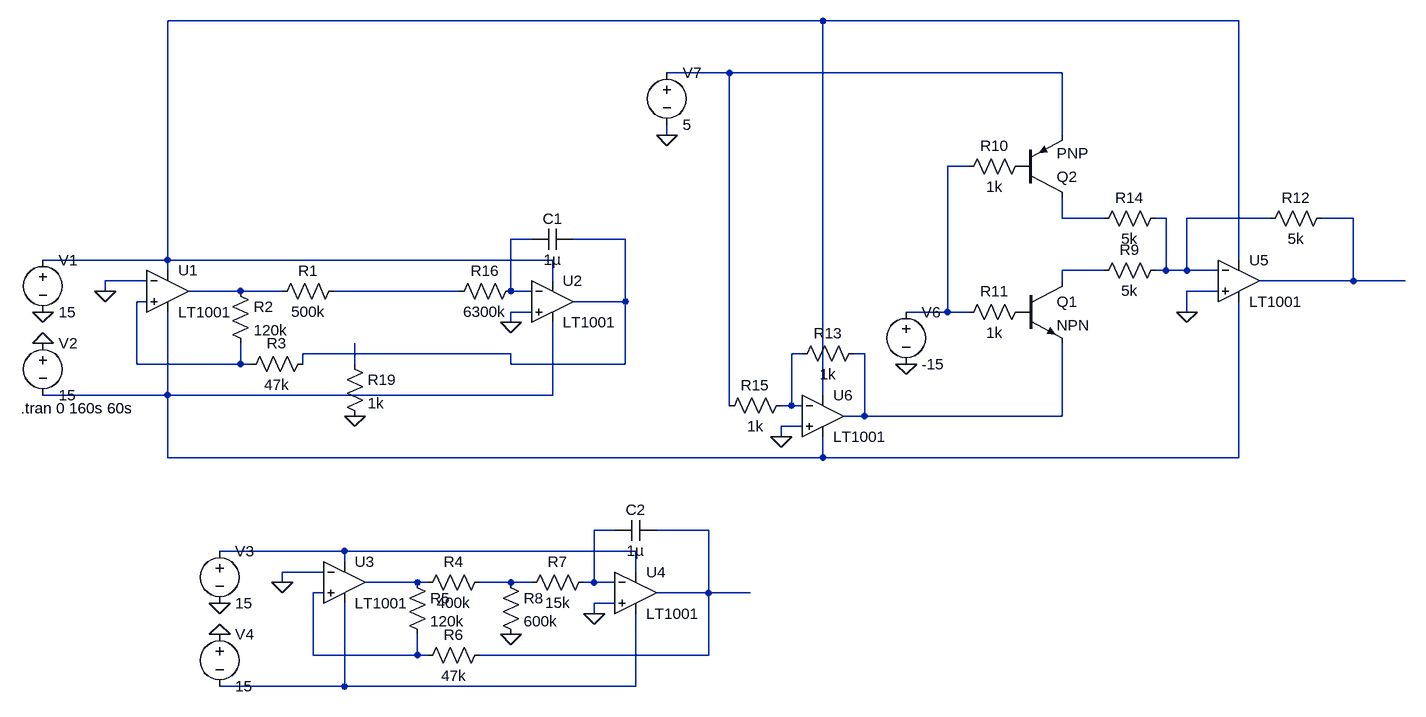
[diagram p0: schematic Supersaw.asc]
Supersaw.asc, the LTspice schematic file:
Version 4
SHEET 1 1540 932
WIRE 512 -256 -496 -256
WIRE 1152 -256 512 -256
WIRE 368 -176 272 -176
WIRE 880 -176 368 -176
WIRE 272 -80 272 -96
WIRE 880 -80 880 -176
WIRE 736 -32 704 -32
WIRE 880 48 880 16
WIRE 944 48 880 48
WIRE 1040 48 1024 48
WIRE 1200 48 1072 48
WIRE 1328 48 1280 48
WIRE 64 80 32 80
WIRE 208 80 128 80
WIRE -496 112 -496 -256
WIRE -496 112 -688 112
WIRE 96 112 -496 112
WIRE 1152 112 1152 -256
WIRE -496 128 -496 112
WIRE 944 128 880 128
WIRE 1040 128 1040 48
WIRE 1040 128 1024 128
WIRE 1072 128 1072 48
WIRE 1072 128 1040 128
WIRE 1120 128 1072 128
WIRE -528 144 -592 144
WIRE 96 144 96 112
WIRE 880 144 880 128
WIRE 1328 144 1328 48
WIRE 1328 144 1184 144
WIRE 1408 144 1328 144
WIRE -592 160 -592 144
WIRE -384 160 -464 160
WIRE -320 160 -384 160
WIRE -48 160 -240 160
WIRE 32 160 32 80
WIRE 64 160 32 160
WIRE 1120 160 1072 160
WIRE -528 176 -544 176
WIRE 208 176 208 80
WIRE 208 176 128 176
WIRE 64 192 32 192
WIRE 704 192 704 -32
WIRE 704 192 640 192
WIRE 736 192 704 192
WIRE 1072 192 1072 160
WIRE 32 208 32 192
WIRE 32 256 -288 256
WIRE 480 256 464 256
WIRE 576 256 560 256
WIRE -544 272 -544 176
WIRE -384 272 -384 240
WIRE -384 272 -544 272
WIRE -368 272 -384 272
WIRE -288 272 -288 256
WIRE -208 272 -208 240
WIRE 32 272 32 256
WIRE 208 272 208 176
WIRE 208 272 32 272
WIRE -496 320 -496 192
WIRE -496 320 -688 320
WIRE 96 320 96 208
WIRE 96 320 -496 320
WIRE 512 320 512 -256
WIRE 368 336 368 -176
WIRE 464 336 464 256
WIRE 464 336 448 336
WIRE 480 336 464 336
WIRE 576 352 576 256
WIRE 576 352 544 352
WIRE 880 352 880 240
WIRE 880 352 576 352
WIRE 480 368 448 368
WIRE 448 384 448 368
WIRE -496 416 -496 320
WIRE 512 416 512 384
WIRE 512 416 -496 416
WIRE 1152 416 1152 176
WIRE 1152 416 512 416
WIRE 192 528 160 528
WIRE 336 528 256 528
WIRE -224 560 -416 560
WIRE 224 560 -224 560
WIRE -224 576 -224 560
WIRE -256 592 -320 592
WIRE 224 592 224 560
WIRE -320 608 -320 592
WIRE -112 608 -192 608
WIRE -96 608 -112 608
WIRE 32 608 -16 608
WIRE 64 608 32 608
WIRE 160 608 160 528
WIRE 160 608 144 608
WIRE 192 608 160 608
WIRE -256 624 -272 624
WIRE 336 624 336 528
WIRE 336 624 256 624
WIRE 400 624 336 624
WIRE 192 640 160 640
WIRE 160 656 160 640
WIRE -272 720 -272 624
WIRE -112 720 -112 688
WIRE -112 720 -272 720
WIRE -96 720 -112 720
WIRE 336 720 336 624
WIRE 336 720 -16 720
WIRE -224 768 -224 640
WIRE -224 768 -416 768
WIRE 224 768 224 656
WIRE 224 768 -224 768
FLAG -592 160 0
FLAG 32 208 0
FLAG -688 192 0
FLAG -688 240 0
FLAG -320 608 0
FLAG 160 656 0
FLAG -416 640 0
FLAG -416 688 0
FLAG 32 688 0
FLAG 640 272 0
FLAG 1072 192 0
FLAG 272 -80 0
FLAG 448 384 0
FLAG -208 352 0
SYMBOL Opamps\\LT1001 -496 96 R0
SYMATTR InstName U1
SYMBOL Opamps\\LT1001 96 112 R0
SYMATTR InstName U2
SYMBOL res -336 176 R270
WINDOW 0 32 56 VTop 2
WINDOW 3 0 56 VBottom 2
SYMATTR InstName R1
SYMATTR Value 500k
SYMBOL res -400 144 R0
SYMATTR InstName R2
SYMATTR Value 120k
SYMBOL res -272 256 R90
WINDOW 0 0 56 VBottom 2
WINDOW 3 32 56 VTop 2
SYMATTR InstName R3
SYMATTR Value 47k
SYMBOL cap 64 96 R270
WINDOW 0 32 32 VTop 2
WINDOW 3 0 32 VBottom 2
SYMATTR InstName C1
SYMATTR Value 1µ
SYMBOL voltage -688 96 R0
WINDOW 123 0 0 Left 2
WINDOW 39 0 0 Left 2
SYMATTR InstName V1
SYMATTR Value 15
SYMBOL voltage -688 224 R0
WINDOW 123 0 0 Left 2
WINDOW 39 0 0 Left 2
SYMATTR InstName V2
SYMATTR Value 15
SYMBOL Opamps\\LT1001 -224 544 R0
SYMATTR InstName U3
SYMBOL Opamps\\LT1001 224 560 R0
SYMATTR InstName U4
SYMBOL res -112 624 R270
WINDOW 0 32 56 VTop 2
WINDOW 3 0 56 VBottom 2
SYMATTR InstName R4
SYMATTR Value 400k
SYMBOL res -128 592 R0
SYMATTR InstName R5
SYMATTR Value 120k
SYMBOL res 0 704 R90
WINDOW 0 0 56 VBottom 2
WINDOW 3 32 56 VTop 2
SYMATTR InstName R6
SYMATTR Value 47k
SYMBOL cap 192 544 R270
WINDOW 0 32 32 VTop 2
WINDOW 3 0 32 VBottom 2
SYMATTR InstName C2
SYMATTR Value 1µ
SYMBOL voltage -416 544 R0
WINDOW 123 0 0 Left 2
WINDOW 39 0 0 Left 2
SYMATTR InstName V3
SYMATTR Value 15
SYMBOL voltage -416 672 R0
WINDOW 123 0 0 Left 2
WINDOW 39 0 0 Left 2
SYMATTR InstName V4
SYMATTR Value 15
SYMBOL res 48 624 R270
WINDOW 0 32 56 VTop 2
WINDOW 3 0 56 VBottom 2
SYMATTR InstName R7
SYMATTR Value 15k
SYMBOL res 16 592 R0
SYMATTR InstName R8
SYMATTR Value 600k
SYMBOL npn 816 144 R0
SYMATTR InstName Q1
SYMBOL res 1040 112 R90
WINDOW 0 0 56 VBottom 2
WINDOW 3 32 56 VTop 2
SYMATTR InstName R9
SYMATTR Value 5k
SYMBOL res 720 208 R270
WINDOW 0 32 56 VTop 2
WINDOW 3 0 56 VBottom 2
SYMATTR InstName R11
SYMATTR Value 1k
SYMBOL voltage 640 176 R0
WINDOW 123 0 0 Left 2
WINDOW 39 0 0 Left 2
SYMATTR InstName V6
SYMATTR Value -15
SYMBOL Opamps\\LT1001 1152 80 R0
SYMATTR InstName U5
SYMBOL res 1184 64 R270
WINDOW 0 32 56 VTop 2
WINDOW 3 0 56 VBottom 2
SYMATTR InstName R12
SYMATTR Value 5k
SYMBOL pnp 816 16 M180
SYMATTR InstName Q2
SYMBOL res 720 -16 R270
WINDOW 0 32 56 VTop 2
WINDOW 3 0 56 VBottom 2
SYMATTR InstName R10
SYMATTR Value 1k
SYMBOL voltage 272 -192 R0
WINDOW 123 0 0 Left 2
WINDOW 39 0 0 Left 2
SYMATTR InstName V7
SYMATTR Value 5
SYMBOL res 1040 32 R90
WINDOW 0 0 56 VBottom 2
WINDOW 3 32 56 VTop 2
SYMATTR InstName R14
SYMATTR Value 5k
SYMBOL Opamps\\LT1001 512 288 R0
SYMATTR InstName U6
SYMBOL res 464 272 R270
WINDOW 0 32 56 VTop 2
WINDOW 3 0 56 VBottom 2
SYMATTR InstName R13
SYMATTR Value 1k
SYMBOL res 352 352 R270
WINDOW 0 32 56 VTop 2
WINDOW 3 0 56 VBottom 2
SYMATTR InstName R15
SYMATTR Value 1k
SYMBOL res -64 176 R270
WINDOW 0 32 56 VTop 2
WINDOW 3 0 56 VBottom 2
SYMATTR InstName R16
SYMATTR Value 6300k
SYMBOL res -224 256 R0
SYMATTR InstName R19
SYMATTR Value 1k
TEXT -722 340 Left 2 !.tran 0 160s 60s

The netlist it stands for:
* Supersaw.asc
XU1 N012 0 N001 N016 N010 LT1001  ; pins In+ In- V+ V- OUT
XU2 0 N007 N001 N016 N008 LT1001  ; pins In+ In- V+ V- OUT
R1 N010 N011 500k
R2 N010 N012 120k
R3 N008 N012 47k
C1 N007 N008 1µ
V1 N001 0 15
V2 0 N016 15
XU3 N022 0 N019 N023 N020 LT1001  ; pins In+ In- V+ V- OUT
XU4 0 N017 N019 N023 N018 LT1001  ; pins In+ In- V+ V- OUT
R4 N020 N021 400k
R5 N020 N022 120k
R6 N018 N022 47k
C2 N017 N018 1µ
V3 N019 0 15
V4 0 N023 15
R7 N021 N017 15k
R8 N021 0 600k
Q1 N009 P001 N014 0 NPN
R9 N005 N009 5k
R11 N003 P001 1k
V6 N003 0 -15
XU5 0 N005 N001 N016 N006 LT1001  ; pins In+ In- V+ V- OUT
R12 N005 N006 5k
Q2 N004 P002 N002 0 PNP
R10 N003 P002 1k
V7 N002 0 5
R14 N005 N004 5k
XU6 0 N013 N001 N016 N014 LT1001  ; pins In+ In- V+ V- OUT
R13 N013 N014 1k
R15 N002 N013 1k
R16 N011 N007 6300k
R19 N015 0 1k
.model NPN NPN
.model PNP PNP
.lib standard.bjt
.tran 0 160s 60s
.lib LTC.lib
.backanno
.end